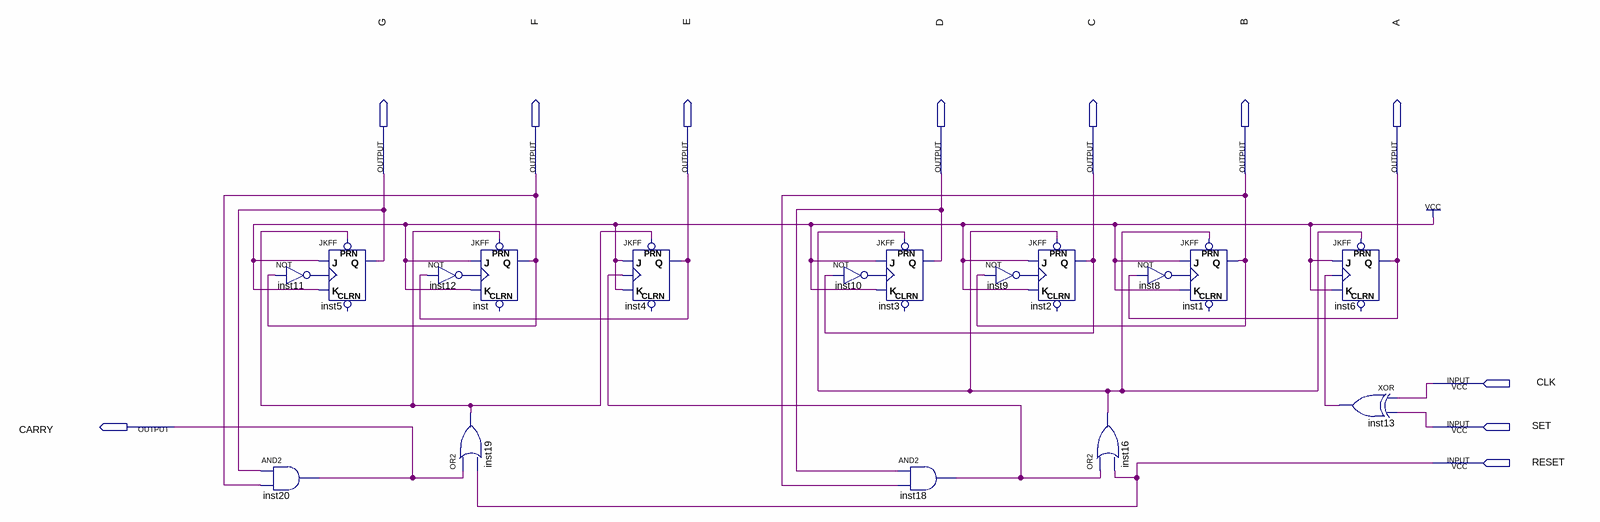
[diagram p0: schematic sheet]
// Quartus schematic contador0a59.bdf as structural Verilog: 17 symbols, 11 pins
module contador0a59 (
  input  CLK,
  input  SET,
  input  RESET,
  output G,
  output F,
  output E,
  output D,
  output C,
  output B,
  output A,
  output CARRY
);

  wire inst8_out, inst9_out, inst10_out, inst11_out, inst12_out, inst13_out, inst16_out, inst18_out,
       inst19_out;

  not inst11 (inst11_out, F);
  and inst20 (CARRY, G, F);
  JKFF inst5 (.PRN(inst19_out), .K(1'b1), .J(1'b1), .CLK(inst11_out), .Q(G));  // open: CLRN
  JKFF inst (.PRN(inst19_out), .K(1'b1), .J(1'b1), .CLK(inst12_out), .Q(F));  // open: CLRN
  not inst12 (inst12_out, E);
  or inst19 (inst19_out, CARRY, RESET);
  JKFF inst4 (.PRN(inst19_out), .K(1'b1), .J(1'b1), .CLK(inst18_out), .Q(E));  // open: CLRN
  JKFF inst3 (.PRN(inst16_out), .K(1'b1), .J(1'b1), .CLK(inst10_out), .Q(D));  // open: CLRN
  not inst10 (inst10_out, C);
  and inst18 (inst18_out, D, B);
  not inst9 (inst9_out, B);
  JKFF inst2 (.PRN(inst16_out), .K(1'b1), .J(1'b1), .CLK(inst9_out), .Q(C));  // open: CLRN
  or inst16 (inst16_out, inst18_out, RESET);
  not inst8 (inst8_out, A);
  JKFF inst1 (.PRN(inst16_out), .K(1'b1), .J(1'b1), .CLK(inst8_out), .Q(B));  // open: CLRN
  JKFF inst6 (.PRN(inst16_out), .K(1'b1), .J(1'b1), .CLK(inst13_out), .Q(A));  // open: CLRN
  xor inst13 (inst13_out, CLK, SET);
endmodule
